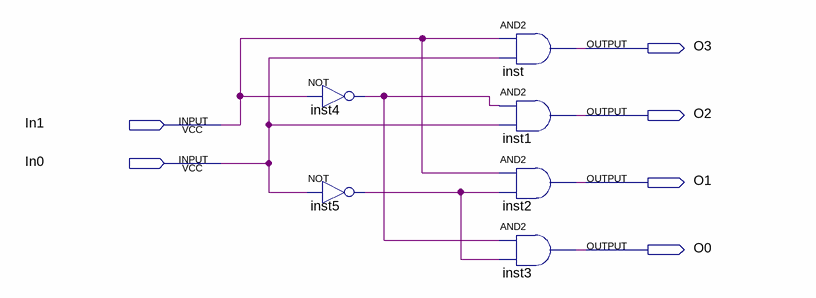
[diagram p0: schematic sheet]
// Quartus schematic dec24.bdf as structural Verilog: 6 symbols, 6 pins
module dec24 (
  input  In1,
  input  In0,
  output O3,
  output O2,
  output O1,
  output O0
);

  wire inst4_out, inst5_out;

  not inst4 (inst4_out, In1);
  not inst5 (inst5_out, In0);
  and inst (O3, In1, In0);
  and inst1 (O2, inst4_out, In0);
  and inst2 (O1, In1, inst5_out);
  and inst3 (O0, inst4_out, inst5_out);
endmodule
